# EasyEDA schematic SCH_最丐17Toutch机械数字键盘_2024-07-19.json
TITLE: Sheet_1; REV: 1.0; Date: 2020-12-20; Sheet: 1/1; Drawn By: yANgZEN; Company: Your Company
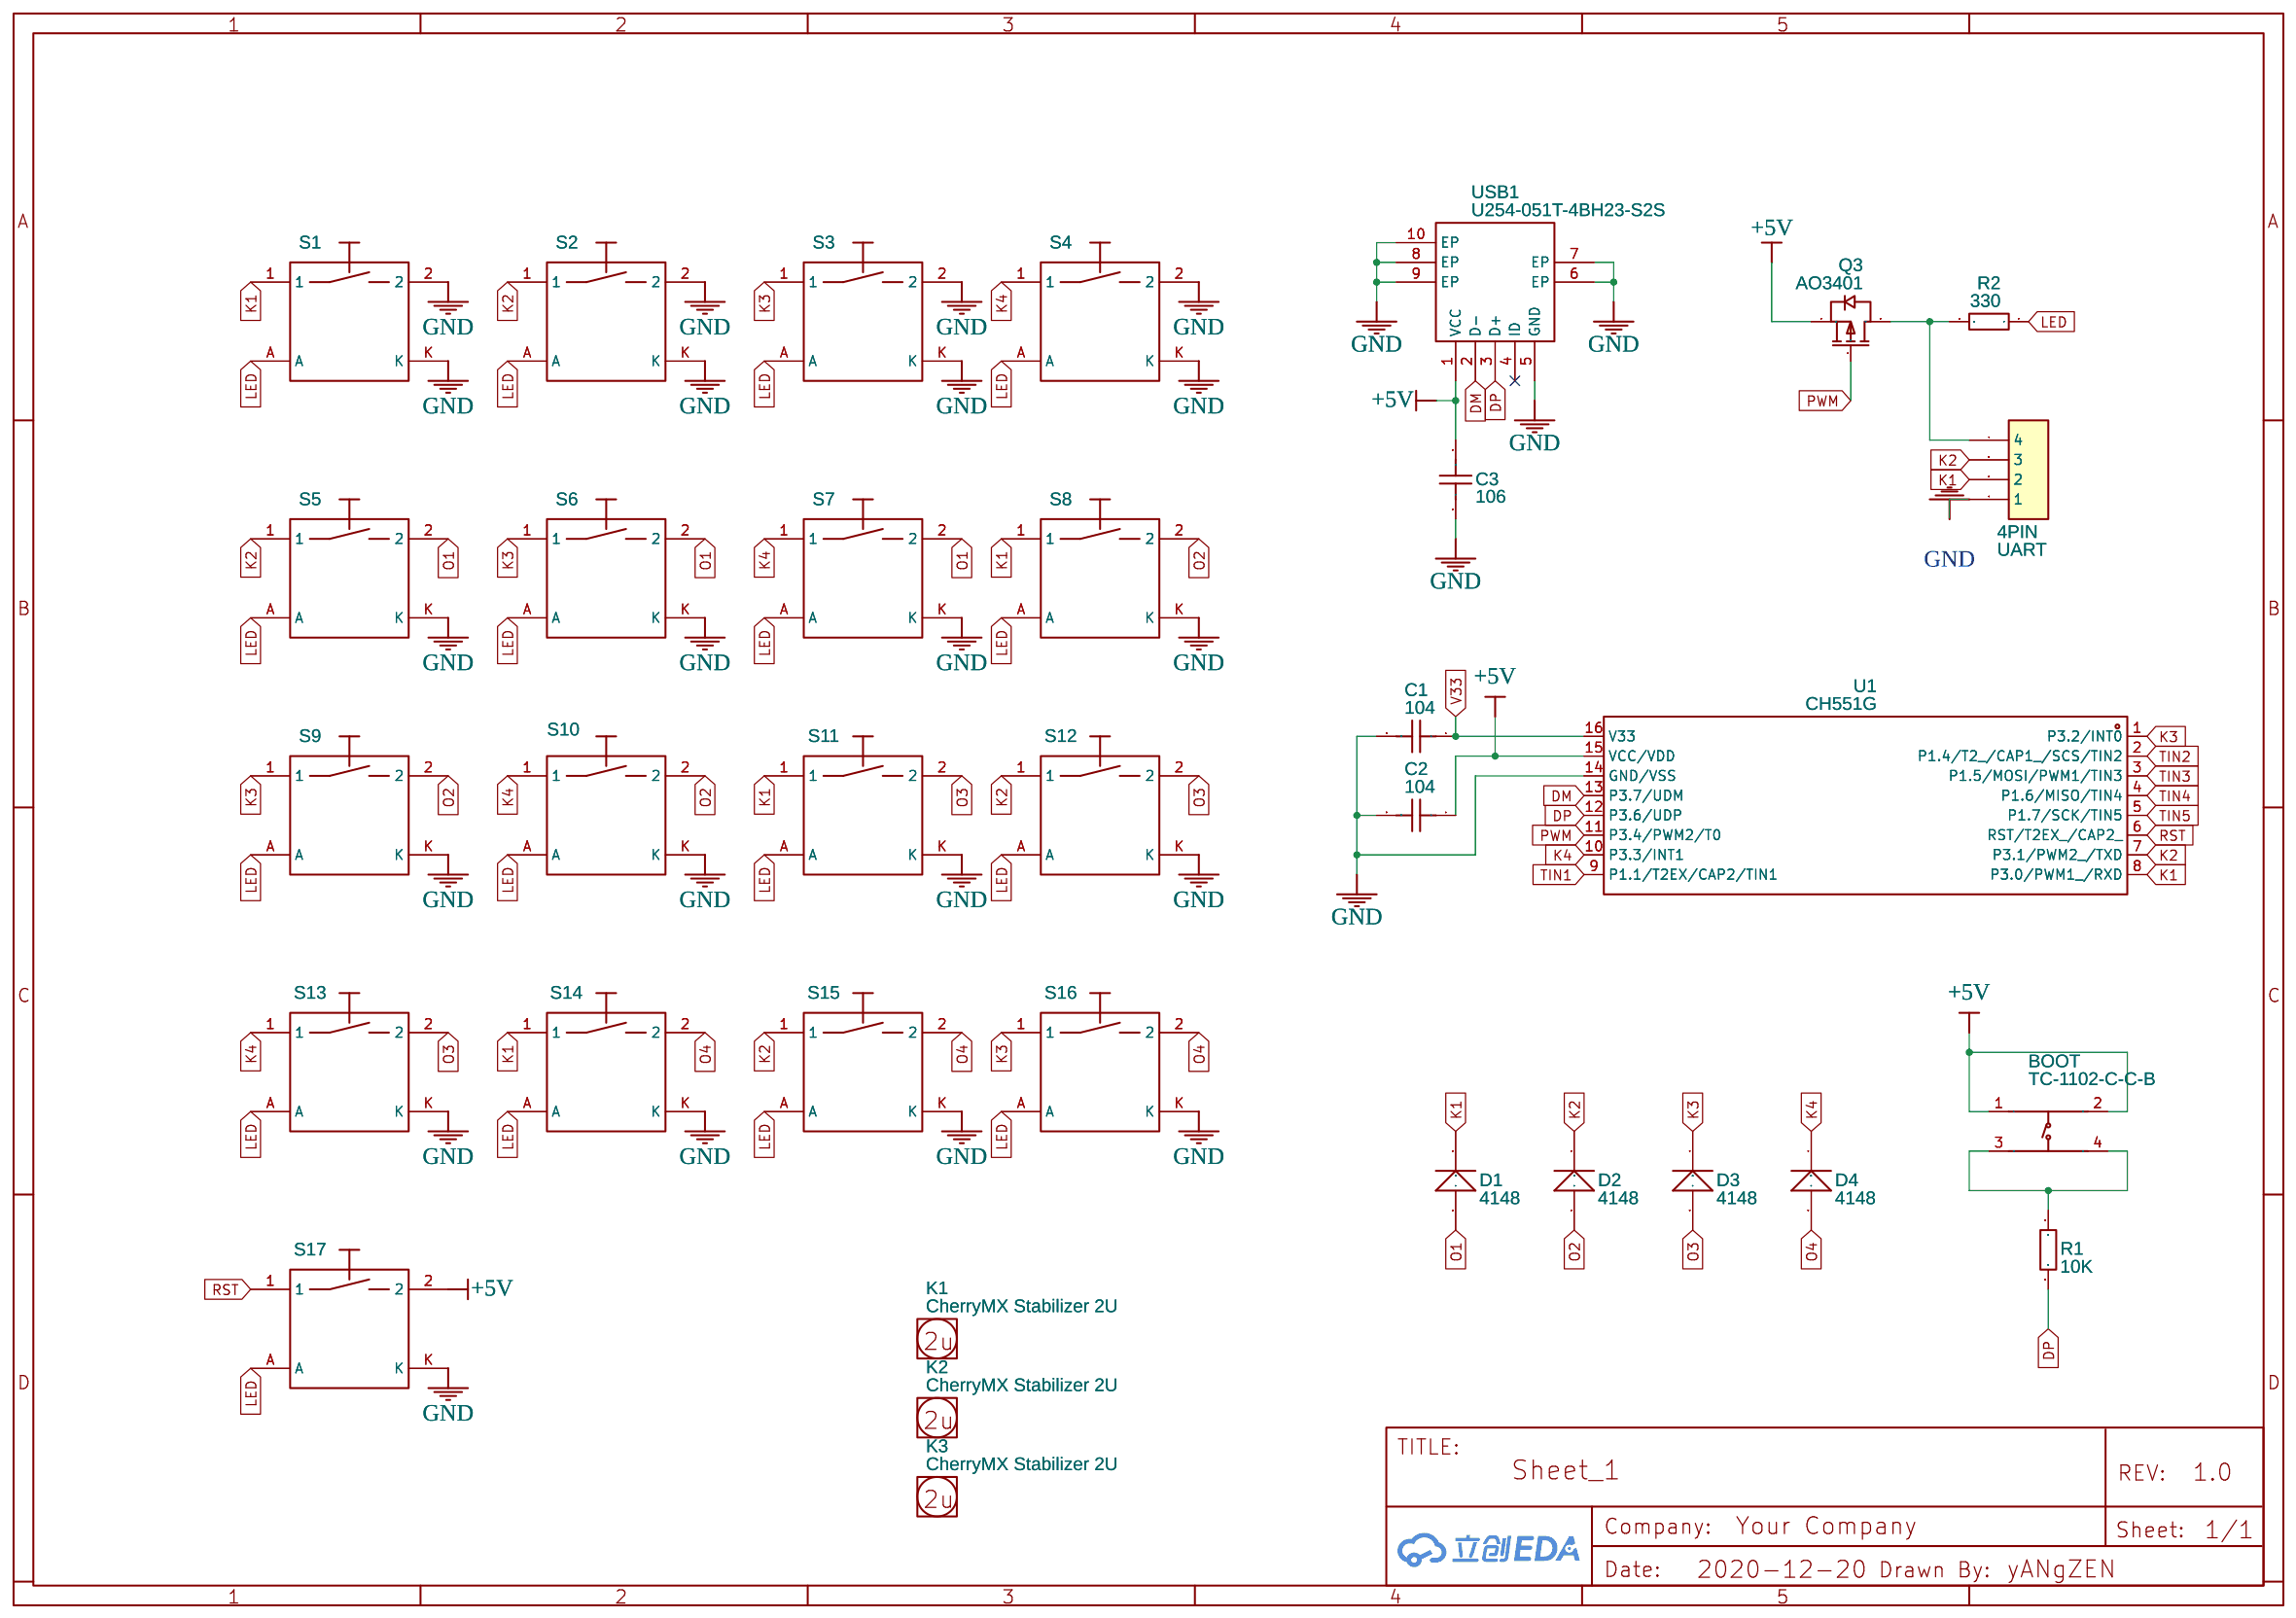
[diagram p0: schematic sheet]

## Parts
BOOT  TC-1102-C-C-B  [SW-TH_4P-L6.0-W6.0-P4.50-LS6.5]
C1  104  [C0603]
C2  104  [C0603]
C3  106  [C0603]
D1  4148  [LL-34_L3.5-W1.5-RD]
D2  4148  [LL-34_L3.5-W1.5-RD]
D3  4148  [LL-34_L3.5-W1.5-RD]
D4  4148  [LL-34_L3.5-W1.5-RD]
K1  CherryMX Stabilizer 2U  [CHERRY_MX_2U]
K2  CherryMX Stabilizer 2U  [CHERRY_MX_2U]
K3  CherryMX Stabilizer 2U  [CHERRY_MX_2U]
Q3  AO3401  [SOT-23-3_L2.9-W1.6-P1.90-LS2.8-BR]
R1  10K  [R0603]
R2  330  [R0603]
S1  高特插拔轴（两脚F3）  [高特插拔轴 2脚LED]
S2  高特插拔轴（两脚F3）  [高特插拔轴 2脚LED]
S3  高特插拔轴（两脚F3）  [高特插拔轴 2脚LED]
S4  高特插拔轴（两脚F3）  [高特插拔轴 2脚LED]
S5  高特插拔轴（两脚F3）  [高特插拔轴 2脚LED]
S6  高特插拔轴（两脚F3）  [高特插拔轴 2脚LED]
S7  高特插拔轴（两脚F3）  [高特插拔轴 2脚LED]
S8  高特插拔轴（两脚F3）  [高特插拔轴 2脚LED]
S9  高特插拔轴（两脚F3）  [高特插拔轴 2脚LED]
S10  高特插拔轴（两脚F3）  [高特插拔轴 2脚LED]
S11  高特插拔轴（两脚F3）  [高特插拔轴 2脚LED]
S12  高特插拔轴（两脚F3）  [高特插拔轴 2脚LED]
S13  高特插拔轴（两脚F3）  [高特插拔轴 2脚LED]
S14  高特插拔轴（两脚F3）  [高特插拔轴 2脚LED]
S15  高特插拔轴（两脚F3）  [高特插拔轴 2脚LED]
S16  高特插拔轴（两脚F3）  [高特插拔轴 2脚LED]
S17  高特插拔轴（两脚F3）  [高特插拔轴 2脚LED]
U1  CH551G  [SOP-16_L10.0-W3.9-P1.27-LS6.0-BL]
UART  4PIN  [HDR1X4]
USB1  U254-051T-4BH23-S2S  [MICRO-USB-SMD_105017-0001]

## Library data of the parts
BOOT = TS665CJ: Supplier: LCSC; Supplier Part: C381012; Manufacturer: XKB Enterprise; Contributor: LCSC
C1-C3 = 0603B331K251CT: Supplier: LCSC; Supplier Part: C458879; Manufacturer: Walsin Tech Corp; Contributor: LCSC
D1-D4 = TCLL4148: Supplier: LCSC; Manufacturer: Tak Cheong; Contributor: LCSC; Supplier Part: C127077; LCSC Assembly: Yes; SMT Type: Extend
K1-K3 = CherryMX Stabilizer 2U: Manufacturer Part: Cherry MX; Contributor: poiuytq
Q3 = AO3401_C305433: Supplier: LCSC; Supplier Part: C305433; Manufacturer: Foshan Blue Rocket Elec; Contributor: LCSC
R1 R2 = AC0603FR-07210KL: Supplier: LCSC; Supplier Part: C227705; Manufacturer: YAGEO; Contributor: LCSC
S1-S17 = 高特插拔轴（两脚F3）: Supplier Part: C400226; Supplier: LCSC; Contributor: yANgZEN
U1 = CH551G: Supplier: LCSC; Manufacturer: WCH; Supplier Part: C108958
UART = 4PIN: Manufacturer Part: X6511WV-04H-C30D60; Supplier Part: C706876; Manufacturer: XKB Connectivity; Supplier: LCSC
USB1 = 105017-0001: Supplier: LCSC; Manufacturer: XKB Enterprise; Contributor: LCSC; Supplier Part: C319163

## Nets
+5V: BOOT.1(A) BOOT.2(B) C2.1 C3.1 Q3.2(S) S17.2 U1.15(VCC/VDD) USB1.1(VCC)
GND: C1.2 C2.2 C3.2 S1.2 S1.K S2.2 S2.K S3.2 S3.K S4.2 S4.K S5.K S6.K S7.K S8.K S9.K S10.K S11.K S12.K S13.K S14.K S15.K S16.K S17.K U1.14(GND/VSS) UART.1 USB1.5(GND) USB1.6(EP) USB1.7(EP) USB1.8(EP) USB1.9(EP) USB1.10(EP)
V33: C1.1 U1.16(V33)
DM: U1.13(P3.7/UDM) USB1.2(D-)
DP: R1.2 U1.12(P3.6/UDP) USB1.3(D+)
K1: D1.1(C) S1.1 S8.1 S11.1 S14.1 U1.8(P3.0/PWM1_/RXD) UART.2
K2: D2.1(C) S2.1 S5.1 S12.1 S15.1 U1.7(P3.1/PWM2_/TXD) UART.3
K3: D3.1(C) S3.1 S6.1 S9.1 S16.1 U1.1(P3.2/INT0)
K4: D4.1(C) S4.1 S7.1 S10.1 S13.1 U1.10(P3.3/INT1)
LED: R2.1 S1.A S2.A S3.A S4.A S5.A S6.A S7.A S8.A S9.A S10.A S11.A S12.A S13.A S14.A S15.A S16.A S17.A
O1: D1.2(A) S5.2 S6.2 S7.2
O2: D2.2(A) S8.2 S9.2 S10.2
O3: D3.2(A) S11.2 S12.2 S13.2
O4: D4.2(A) S14.2 S15.2 S16.2
PWM: Q3.1(G) U1.11(P3.4/PWM2/T0)
RST: S17.1 U1.6(RST/T2EX_/CAP2_)
TIN1: U1.9(P1.1/T2EX/CAP2/TIN1)
TIN2: U1.2(P1.4/T2_/CAP1_/SCS/TIN2)
TIN3: U1.3(P1.5/MOSI/PWM1/TIN3)
TIN4: U1.4(P1.6/MISO/TIN4)
TIN5: U1.5(P1.7/SCK/TIN5)
Net-(BOOT-3): BOOT.3(C) BOOT.4(D) R1.1
Net-(Q3-3): Q3.3(D) R2.2 UART.4

Not connected (* = marked no-connect by the designer): USB1 4(ID)*
